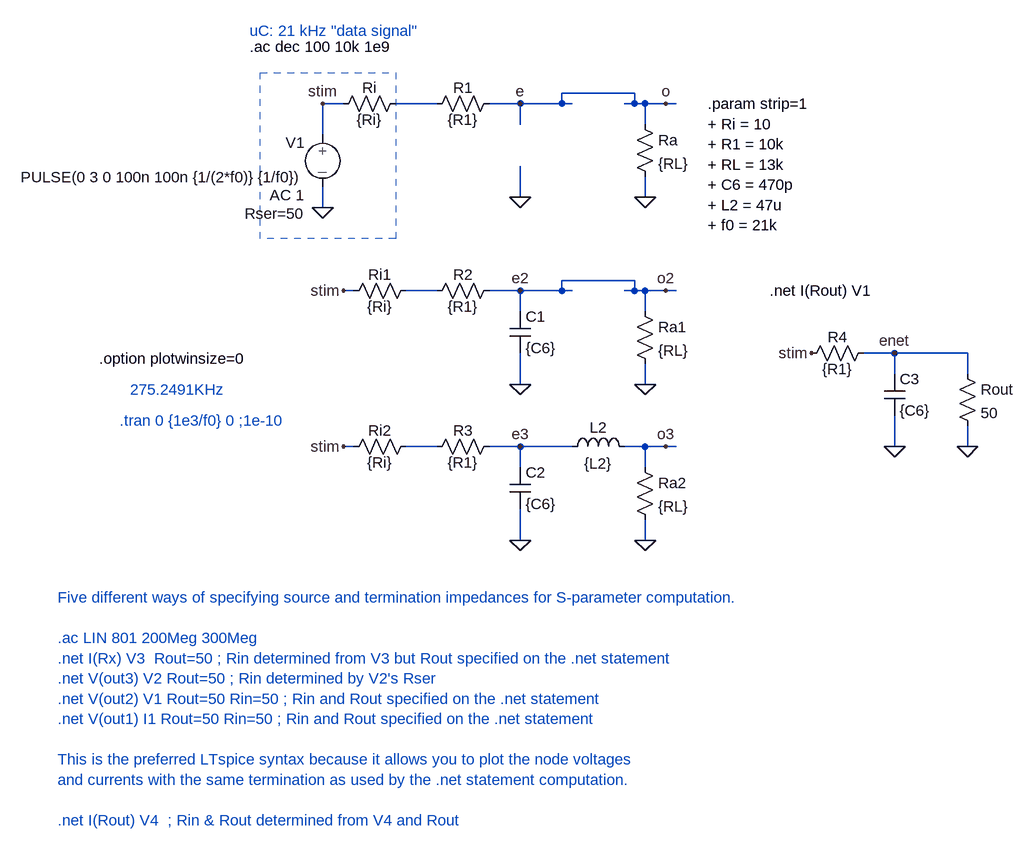
[diagram p0: schematic labor_stripline.asc]
labor_stripline.asc, the LTspice schematic file:
Version 4
SHEET 1 1676 1200
WIRE 304 96 192 96
WIRE -144 112 -176 112
WIRE 0 112 -64 112
WIRE 128 112 80 112
WIRE 192 112 192 96
WIRE 192 112 128 112
WIRE 208 112 192 112
WIRE 304 112 304 96
WIRE 304 112 288 112
WIRE 320 112 304 112
WIRE 352 112 320 112
WIRE 368 112 352 112
WIRE 128 144 128 112
WIRE 320 144 320 112
WIRE -176 160 -176 112
WIRE 128 256 128 208
WIRE 320 256 320 224
WIRE -176 272 -176 240
WIRE 304 384 192 384
WIRE -128 400 -144 400
WIRE 0 400 -48 400
WIRE 128 400 80 400
WIRE 192 400 192 384
WIRE 192 400 128 400
WIRE 208 400 192 400
WIRE 304 400 304 384
WIRE 304 400 288 400
WIRE 320 400 304 400
WIRE 352 400 320 400
WIRE 368 400 352 400
WIRE 128 432 128 400
WIRE 320 432 320 400
WIRE 704 496 656 496
WIRE 816 496 704 496
WIRE 704 528 704 496
WIRE 816 528 816 496
WIRE 128 544 128 496
WIRE 320 544 320 512
WIRE -128 640 -144 640
WIRE 0 640 -48 640
WIRE 128 640 80 640
WIRE 208 640 128 640
WIRE 320 640 288 640
WIRE 352 640 320 640
WIRE 368 640 352 640
WIRE 704 640 704 592
WIRE 816 640 816 608
WIRE 128 672 128 640
WIRE 320 672 320 640
WIRE 128 784 128 736
WIRE 320 784 320 752
FLAG 320 256 0
FLAG 128 256 0
FLAG -176 272 0
FLAG 128 112 e
FLAG 352 112 o
FLAG -176 112 stim
FLAG 320 544 0
FLAG 128 544 0
FLAG 128 400 e2
FLAG 352 400 o2
FLAG -144 400 stim
FLAG 320 784 0
FLAG 128 784 0
FLAG 128 640 e3
FLAG 352 640 o3
FLAG -144 640 stim
FLAG 704 640 0
FLAG 704 496 enet
FLAG 576 496 stim
FLAG 816 640 0
SYMBOL res -160 128 R270
WINDOW 0 25 56 VTop 2
WINDOW 3 7 56 VBottom 2
SYMATTR InstName Ri
SYMATTR Value {Ri}
SYMBOL res 304 128 R0
SYMATTR InstName Ra
SYMATTR Value {RL}
SYMBOL BOR_sym\\source-V -176 144 M0
WINDOW 123 28 109 Left 2
WINDOW 39 28 137 Left 2
SYMATTR Value2 AC 1
SYMATTR SpiceLine Rser=50
SYMATTR InstName V1
SYMATTR Value PULSE(0 3 0 100n 100n {1/(2*f0)} {1/f0})
SYMBOL res -16 128 R270
WINDOW 0 25 56 VTop 2
WINDOW 3 7 56 VBottom 2
SYMATTR InstName R1
SYMATTR Value {R1}
SYMBOL cap 112 432 R0
SYMATTR InstName C1
SYMATTR Value {C6}
SYMBOL res 304 416 R0
SYMATTR InstName Ra1
SYMATTR Value {RL}
SYMBOL res -16 416 R270
WINDOW 0 25 56 VTop 2
WINDOW 3 7 56 VBottom 2
SYMATTR InstName R2
SYMATTR Value {R1}
SYMBOL ind 192 656 R270
WINDOW 0 30 56 VTop 2
WINDOW 3 6 56 VBottom 2
SYMATTR InstName L2
SYMATTR Value {L2}
SYMBOL res -144 416 R270
WINDOW 0 25 56 VTop 2
WINDOW 3 7 56 VBottom 2
SYMATTR InstName Ri1
SYMATTR Value {Ri}
SYMBOL cap 112 672 R0
SYMATTR InstName C2
SYMATTR Value {C6}
SYMBOL res 304 656 R0
SYMATTR InstName Ra2
SYMATTR Value {RL}
SYMBOL res -16 656 R270
WINDOW 0 25 56 VTop 2
WINDOW 3 7 56 VBottom 2
SYMATTR InstName R3
SYMATTR Value {R1}
SYMBOL res -144 656 R270
WINDOW 0 25 56 VTop 2
WINDOW 3 7 56 VBottom 2
SYMATTR InstName Ri2
SYMATTR Value {Ri}
SYMBOL cap 688 528 R0
SYMATTR InstName C3
SYMATTR Value {C6}
SYMBOL res 560 512 R270
WINDOW 0 25 56 VTop 2
WINDOW 3 7 56 VBottom 2
SYMATTR InstName R4
SYMATTR Value {R1}
SYMBOL res 800 512 R0
SYMATTR InstName Rout
SYMATTR Value 50
TEXT -288 24 Left 2 !.ac dec 100 10k 1e9
TEXT -288 0 Left 2 ;uC: 21 kHz "data signal"
TEXT 416 112 Left 2 !.param strip=1\n+ Ri = 10\n+ R1 = 10k\n+ RL = 13k\n+ C6 = 470p\n+ L2 = 47u\n+ f0 = 21k
TEXT -488 600 Left 2 ;.tran 0 {1e3/f0} 0 ;1e-10
TEXT -472 552 Left 2 ;275.2491KHz
TEXT -520 504 Left 2 !.option plotwinsize=0
TEXT -584 872 Left 2 ;Five different ways of specifying source and termination impedances for S-parameter computation.\n \n.ac LIN 801 200Meg 300Meg\n.net I(Rx) V3  Rout=50 ; Rin determined from V3 but Rout specified on the .net statement\n.net V(out3) V2 Rout=50 ; Rin determined by V2's Rser\n.net V(out2) V1 Rout=50 Rin=50 ; Rin and Rout specified on the .net statement\n.net V(out1) I1 Rout=50 Rin=50 ; Rin and Rout specified on the .net statement\n \nThis is the preferred LTspice syntax because it allows you to plot the node voltages\nand currents with the same termination as used by the .net statement computation.\n \n.net I(Rout) V4  ; Rin & Rout determined from V4 and Rout
TEXT 512 400 Left 2 !.net I(Rout) V1
RECTANGLE Normal -64 320 -272 64 2

The netlist it stands for:
* labor_stripline.asc
Ri stim N001 {Ri}
Ra o 0 {RL}
V1 stim 0 PULSE(0 3 0 100n 100n {1/(2*f0)} {1/f0}) AC 1 Rser=50
R1 N001 o {R1}
C1 o2 0 {C6}
Ra1 o2 0 {RL}
R2 N002 o2 {R1}
L2 e3 o3 {L2}
Ri1 stim N002 {Ri}
C2 e3 0 {C6}
Ra2 o3 0 {RL}
R3 N003 e3 {R1}
Ri2 stim N003 {Ri}
C3 enet 0 {C6}
R4 stim enet {R1}
Rout enet 0 50
.ac dec 100 10k 1e9
* uC: 21 kHz "data signal"
.param strip=1
+ Ri = 10
+ R1 = 10k
+ RL = 13k
+ C6 = 470p
+ L2 = 47u
+ f0 = 21k
* .tran 0 {1e3/f0} 0 ;1e-10
* 275.2491KHz
.option plotwinsize=0
* Five different ways of specifying source and termination impedances for S-parameter computation.
* .ac LIN 801 200Meg 300Meg
* .net I(Rx) V3  Rout=50 ; Rin determined from V3 but Rout specified on the .net statement
* .net V(out3) V2 Rout=50 ; Rin determined by V2's Rser
* .net V(out2) V1 Rout=50 Rin=50 ; Rin and Rout specified on the .net statement
* .net V(out1) I1 Rout=50 Rin=50 ; Rin and Rout specified on the .net statement
* This is the preferred LTspice syntax because it allows you to plot the node voltages
* and currents with the same termination as used by the .net statement computation.
* .net I(Rout) V4  ; Rin & Rout determined from V4 and Rout
.net I(Rout) V1
.backanno
.end